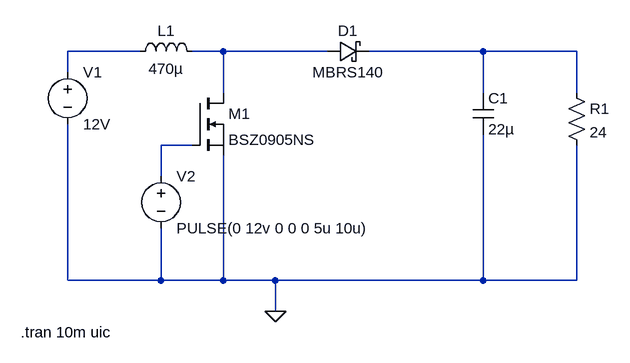
[diagram p0: schematic Boost-Converter-LTspice.asc]
Boost-Converter-LTspice.asc, the LTspice schematic file:
Version 4.1
SHEET 1 880 680
WIRE 112 96 0 96
WIRE 240 96 192 96
WIRE 400 96 240 96
WIRE 640 96 464 96
WIRE 784 96 640 96
WIRE 0 128 0 96
WIRE 240 160 240 96
WIRE 640 160 640 96
WIRE 784 160 784 96
WIRE 192 240 144 240
WIRE 144 288 144 240
WIRE 0 448 0 208
WIRE 144 448 144 368
WIRE 144 448 0 448
WIRE 240 448 240 256
WIRE 240 448 144 448
WIRE 320 448 240 448
WIRE 640 448 640 224
WIRE 640 448 320 448
WIRE 784 448 784 240
WIRE 784 448 640 448
WIRE 320 496 320 448
FLAG 320 496 0
SYMBOL voltage 0 112 R0
WINDOW 123 0 0 Left 0
WINDOW 39 0 0 Left 0
SYMATTR InstName V1
SYMATTR Value 12V
SYMBOL ind 96 112 R270
WINDOW 0 32 56 VTop 2
WINDOW 3 5 56 VBottom 2
SYMATTR InstName L1
SYMATTR Value 470µ
SYMATTR SpiceLine Rser=1m
SYMBOL nmos 192 160 R0
SYMATTR InstName M1
SYMATTR Value BSZ0905NS
SYMBOL voltage 144 272 R0
WINDOW 123 0 0 Left 0
WINDOW 39 0 0 Left 0
SYMATTR InstName V2
SYMATTR Value PULSE(0 12v 0 0 0 5u 10u)
SYMBOL schottky 400 112 R270
WINDOW 0 32 32 VTop 2
WINDOW 3 0 32 VBottom 2
SYMATTR InstName D1
SYMATTR Value MBRS140
SYMATTR Description Diode
SYMATTR Type diode
SYMBOL res 768 144 R0
SYMATTR InstName R1
SYMATTR Value 24
SYMBOL cap 624 160 R0
SYMATTR InstName C1
SYMATTR Value 22µ
TEXT -72 528 Left 2 !.tran 10m uic

The netlist it stands for:
* Boost-Converter-LTspice.asc
V1 N001 0 12V
L1 N001 N002 470µ Rser=1m
M1 N002 N004 0 0 BSZ0905NS
V2 N004 0 PULSE(0 12v 0 0 0 5u 10u)
D1 N002 N003 MBRS140
R1 N003 0 24
C1 N003 0 22µ
.model D D
.lib standard.dio
.model NMOS NMOS
.model PMOS PMOS
.lib standard.mos
.tran 10m uic
.backanno
.end